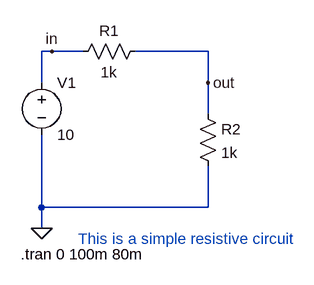
[diagram p0: schematic Simple_Resistive_Circuit.asc]
Simple_Resistive_Circuit.asc, the LTspice schematic file:
Version 4.1
SHEET 1 880 680
WIRE 48 96 32 96
WIRE 96 96 48 96
WIRE 288 96 176 96
WIRE 32 144 32 96
WIRE 288 144 288 96
WIRE 288 192 288 144
WIRE 32 336 32 224
WIRE 288 336 288 272
WIRE 288 336 32 336
WIRE 32 368 32 336
FLAG 32 368 0
FLAG 288 144 out
FLAG 48 96 in
SYMBOL res 192 80 R90
WINDOW 0 0 56 VBottom 2
WINDOW 3 32 56 VTop 2
SYMATTR InstName R1
SYMATTR Value 1k
SYMBOL voltage 32 128 R0
WINDOW 123 0 0 Left 0
WINDOW 39 0 0 Left 0
SYMATTR InstName V1
SYMATTR Value 10
SYMBOL res 272 176 R0
SYMATTR InstName R2
SYMATTR Value 1k
TEXT 88 384 Left 2 ;This is a simple resistive circuit
TEXT 0 408 Left 2 !.tran 0 100m 80m

The netlist it stands for:
* Simple_Resistive_Circuit.asc
R1 out in 1k
V1 in 0 10
R2 out 0 1k
* This is a simple resistive circuit
.tran 0 100m 80m
.backanno
.end